# Altium project HOUZZkitF1_Tester.PrjPcb
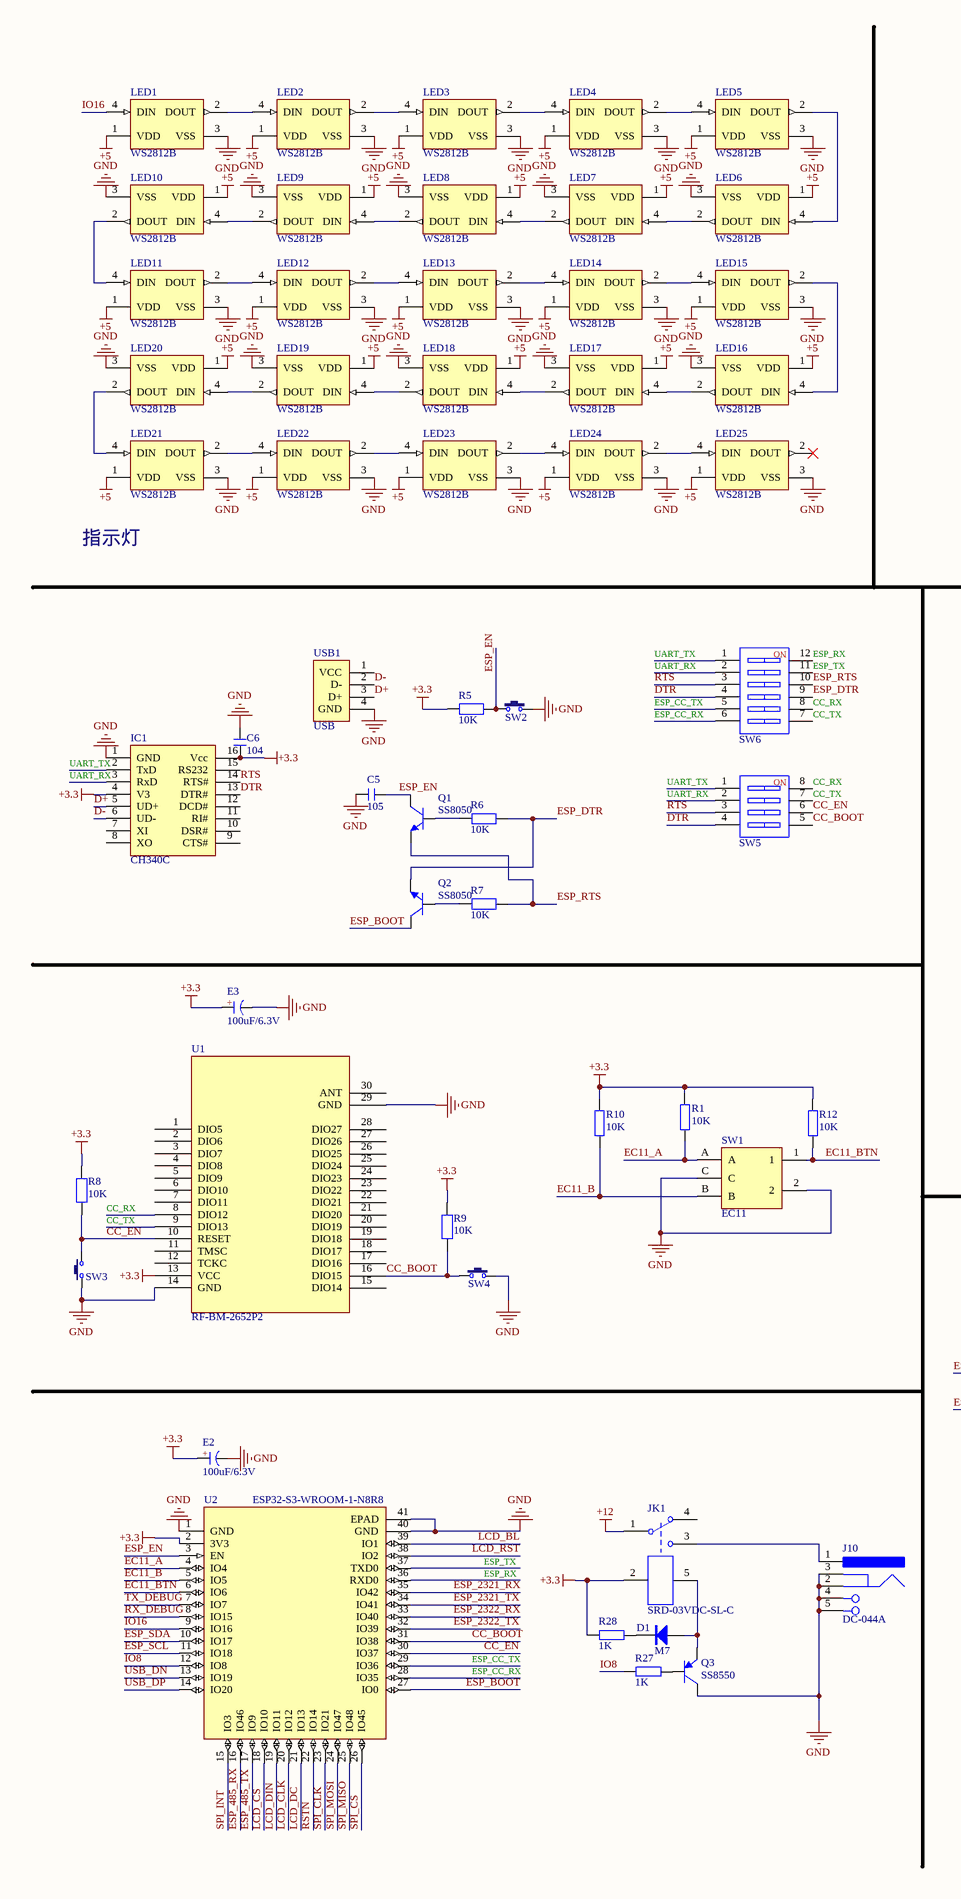
[diagram p0: HOUZZkitF1_Tester.SchDoc, left]
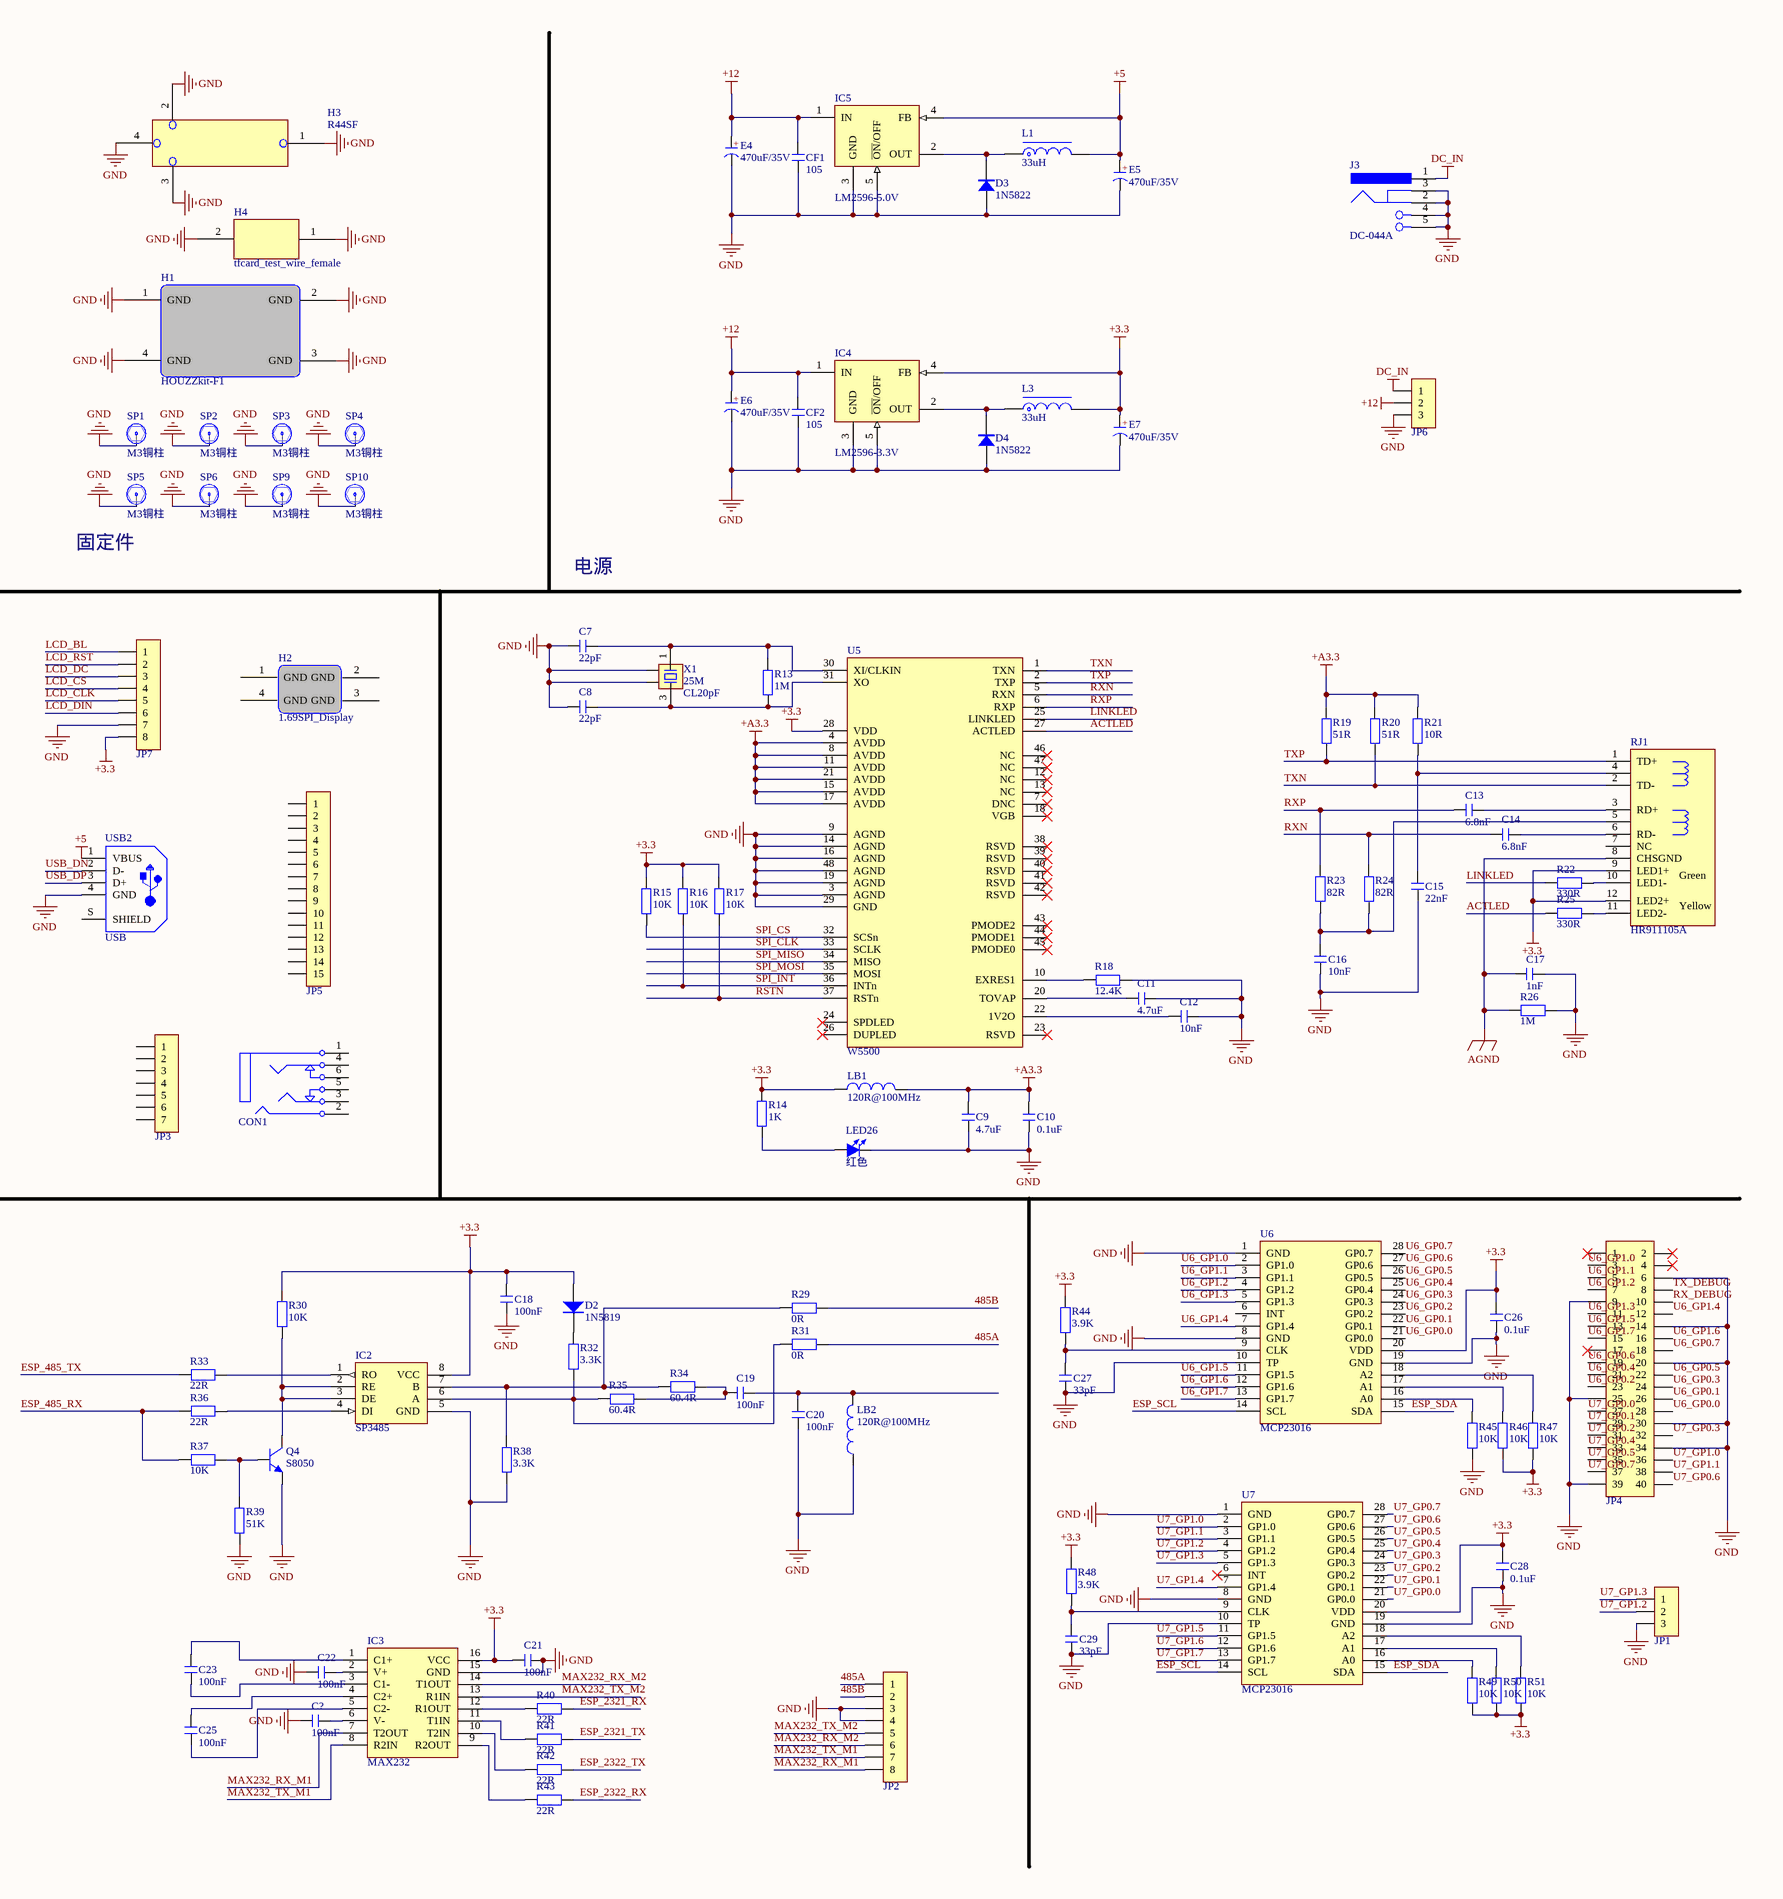
[diagram p1: HOUZZkitF1_Tester.SchDoc, right]
1 sheet, 161 parts. Net scope: global (net labels, ports and power ports of the same name join across sheets).
Board file: HOUZZkitF1_Tester.PcbDoc

## Sheet HOUZZkitF1_Tester.SchDoc
size A2; SheetNumber: 1; SheetTotal: 1

### Parts
C5  105  [C 0603_L]
C6  104  [C 0603_L]
C7  22pF  [C 0603_L]
C8  22pF  [C 0603_L]
C9  4.7uF  [C 0603_L]
C10  0.1uF  [C 0603_L]
C11  4.7uF  [C 0603_L]
C12  10nF  [C 0603_L]
C13  6.8nF  [C 0603_L]
C14  6.8nF  [C 0603_L]
C15  22nF  [C 0603_L]
C16  10nF  [C 0603_L]
C17  1nF  [C 1206_L]
C18  100nF  [C 0603_L]
C19  100nF  [C 0603_L]
C20  100nF  [C 0603_L]
C21  100nF  [C 0603_L]
C22  100nF  [C 0603_L]
C23  100nF  [C 0603_L]
C25  100nF  [C 0603_L]
C26  0.1uF  [C 0603_L]
C27  33pF  [C 0603_L]
C28  0.1uF  [C 0603_L]
C29  33pF  [C 0603_L]
C?  100nF  [C 0603_L]
CF1  105  [C 0603_L]
CF2  105  [C 0603_L]
CON1  PJ342  [PJ342A]  (value not drawn)
D1  M7  [SMA]
D2  1N5819  [SOD-123]
D3  1N5822  [SMB]
D4  1N5822  [SMB]
E2  100uF/6.3V  [CD A(3216)]
E3  100uF/6.3V  [CD A(3216)]
E4  470uF/35V  [CM F(10*10.2)]
E5  470uF/35V  [CM F(10*10.2)]
E6  470uF/35V  [CM F(10*10.2)]
E7  470uF/35V  [CM F(10*10.2)]
H1  HOUZZkit-F1  [HOUZZkit-F1]
H2  1.69SPI_Display  [1.69SPI_Display]
H3  R44SF  [R44SF]
H4  tfcard_test_wire_female  [tfcard_test_wire_female]
IC1  CH340C  [SOP16_N]
IC2  SP3485  [SOP8_N]
IC3  MAX232  [SOP16_L]
IC4  LM2596-3.3V  [TO220-5A]
IC5  LM2596-5.0V  [TO220-5A]
J3  DC-044A  [DC-044A]
J10  DC-044A  [DC-044A]
JK1  SRD-03VDC-SL-C  [SRD-03VDC-SL-C]
JP1  HDR-1X3  [MX 1.25-LS-3P]  (value not drawn)
JP2  HDR-1X8  [MX 1.25-LS-8P]  (value not drawn)
JP3  FPC1.0-7P  [FPC0.5 K-A-7PB]  (value not drawn)
JP4  Header 2X11  [IDC2.54-LI-2x20P]  (value not drawn)
JP5  FPC1.0-15P  [FPC1.0-2H-LI-15P]  (value not drawn)
JP6  HDR-1X3  [XH2.54-WS-3P]  (value not drawn)
JP7  HDR-1X8  [MX 1.25-LS-8P]  (value not drawn)
L1  33uH  [CDRH73]
L3  33uH  [CDRH73]
LB1  120R@100MHz  [FB 0805_L]
LB2  120R@100MHz  [FB 0805_L]
LED1  WS2812B  [WRSM-SMD5050-4_V]
LED2  WS2812B  [WRSM-SMD5050-4_V]
LED3  WS2812B  [WRSM-SMD5050-4_V]
LED4  WS2812B  [WRSM-SMD5050-4_V]
LED5  WS2812B  [WRSM-SMD5050-4_V]
LED6  WS2812B  [WRSM-SMD5050-4_V]
LED7  WS2812B  [WRSM-SMD5050-4_V]
LED8  WS2812B  [WRSM-SMD5050-4_V]
LED9  WS2812B  [WRSM-SMD5050-4_V]
LED10  WS2812B  [WRSM-SMD5050-4_V]
LED11  WS2812B  [WRSM-SMD5050-4_V]
LED12  WS2812B  [WRSM-SMD5050-4_V]
LED13  WS2812B  [WRSM-SMD5050-4_V]
LED14  WS2812B  [WRSM-SMD5050-4_V]
LED15  WS2812B  [WRSM-SMD5050-4_V]
LED16  WS2812B  [WRSM-SMD5050-4_V]
LED17  WS2812B  [WRSM-SMD5050-4_V]
LED18  WS2812B  [WRSM-SMD5050-4_V]
LED19  WS2812B  [WRSM-SMD5050-4_V]
LED20  WS2812B  [WRSM-SMD5050-4_V]
LED21  WS2812B  [WRSM-SMD5050-4_V]
LED22  WS2812B  [WRSM-SMD5050-4_V]
LED23  WS2812B  [WRSM-SMD5050-4_V]
LED24  WS2812B  [WRSM-SMD5050-4_V]
LED25  WS2812B  [WRSM-SMD5050-4_V]
LED26  红色  [LED 0603B]
Q1  SS8050  [SOT23-3N]
Q2  SS8050  [SOT23-3N]
Q3  SS8550  [SOT23-3N]
Q4  S8050  [SOT23-3N]
R1  10K  [R 0603_L]
R5  10K  [R 0603_L]
R6  10K  [R 0603_L]
R7  10K  [R 0603_L]
R8  10K  [R 0603_L]
R9  10K  [R 0603_L]
R10  10K  [R 0603_L]
R12  10K  [R 0603_L]
R13  1M  [R 0603_L]
R14  1K  [R 0603_L]
R15  10K  [R 0603_L]
R16  10K  [R 0603_L]
R17  10K  [R 0603_L]
R18  12.4K  [R 0603_L]
R19  51R  [R 0603_L]
R20  51R  [R 0603_L]
R21  10R  [R 0603_L]
R22  330R  [R 0603_L]
R23  82R  [R 0603_L]
R24  82R  [R 0603_L]
R25  330R  [R 0603_L]
R26  1M  [R 0603_L]
R27  1K  [R 0603_L]
R28  1K  [R 0603_L]
R29  0R  [R 0603_L]
R30  10K  [R 0603_L]
R31  0R  [R 0603_L]
R32  3.3K  [R 0603_L]
R33  22R  [R 0603_L]
R34  60.4R  [R 0603_L]
R35  60.4R  [R 0603_L]
R36  22R  [R 0603_L]
R37  10K  [R 0603_L]
R38  3.3K  [R 0603_L]
R39  51K  [R 0603_L]
R40  22R  [R 0603_L]
R41  22R  [R 0603_L]
R42  22R  [R 0603_L]
R43  22R  [R 0603_L]
R44  3.9K  [R 0603_L]
R45  10K  [R 0603_L]
R46  10K  [R 0603_L]
R47  10K  [R 0603_L]
R48  3.9K  [R 0603_L]
R49  10K  [R 0603_L]
R50  10K  [R 0603_L]
R51  10K  [R 0603_L]
RJ1  HR911105A  [RJ-45A12]
SP1  M3铜柱  [M3x4_N]
SP2  M3铜柱  [M3x4_N]
SP3  M3铜柱  [M3x4_N]
SP4  M3铜柱  [M3x4_N]
SP5  M3铜柱  [M3x4_N]
SP6  M3铜柱  [M3x4_N]
SP9  M3铜柱  [M3x4_N]
SP10  M3铜柱  [M3x4_N]
SW1  EC11  [EC11]
SW2  6x6x5  [TSW DIP-6*6*6_V]  (value not drawn)
SW3  2x4x2  [TS3x4x2]  (value not drawn)
SW4  2x4x2  [TS3x4x2]  (value not drawn)
SW5  CSW-4P  [CSW1.27 SMD-4P]  (value not drawn)
SW6  CSW-6P  [CSW1.27 SMD-6P]  (value not drawn)
U1  RF-BM-2652P2  [RF-BM-2652P2]
U2  ESP32-S3-WROOM-1-N8R8  [ESFS-ESP32-S3-WROOM-1_V]
U5  W5500  [LQFP48 7X7_N]
U6  MCP23016  [SOP28_N]
U7  MCP23016  [SOP28_N]
USB1  USB  [USB-B/S_A]
USB2  USB  [USB-A/S_A]
X1  25M  负载电容: CL20pF  [OSC 3225-4P]

### Nets
+3.3: C6.2 C18.2 C21.2 C26.2 C28.2 D2.1(A) E2.1(A) E3.1(A) E7.1(A) IC1.4(V3) IC1.16(Vcc) IC2.8(VCC) IC3.16(VCC) IC4.4(FB) JK1.2 JP7.8 L3.2 LB1.1 R1.1 R5.2 R8.2 R9.2 R10.1 R12.1 R14.2 R15.2 R16.2 R17.2 R28.2 R30.2 R44.1 R46.2 R47.2 R48.1 R49.2 R50.2 R51.2 RJ1.9(LED1+) RJ1.12(LED2+) U1.13(VCC) U2.2(3V3) U5.28(VDD) U6.20(VDD) U7.20(VDD)
+5: E5.1(A) IC5.4(FB) L1.2 LED1.1(VDD) LED2.1(VDD) LED3.1(VDD) LED4.1(VDD) LED5.1(VDD) LED6.1(VDD) LED7.1(VDD) LED8.1(VDD) LED9.1(VDD) LED10.1(VDD) LED11.1(VDD) LED12.1(VDD) LED13.1(VDD) LED14.1(VDD) LED15.1(VDD) LED16.1(VDD) LED17.1(VDD) LED18.1(VDD) LED19.1(VDD) LED20.1(VDD) LED21.1(VDD) LED22.1(VDD) LED23.1(VDD) LED24.1(VDD) LED25.1(VDD) USB2.1(VBUS)
+12: CF1.2 CF2.2 E4.1(A) E6.1(A) IC4.1(IN) IC5.1(IN) JK1.1 JP6.2
+A3.3: C9.2 C10.2 LB1.2 R19.2 R20.2 R21.2 U5.4(AVDD) U5.8(AVDD) U5.11(AVDD) U5.15(AVDD) U5.17(AVDD) U5.21(AVDD)
AGND: C17.2 R26.2 RJ1.8(CHSGND)
DC_IN: J3.1 JP6.1
GND: C5.1 C6.1 C7.1 C8.1 C9.1 C10.1 C11.2 C12.2 C15.1 C16.1 C17.1 C18.1 C20.1 C21.1 C22.2 C26.1 C27.1 C28.1 C29.1 C?.2 CF1.1 CF2.1 D3.1(A) D4.1(A) E2.2(K) E3.2(K) E4.2(K) E5.2(K) E6.2(K) E7.2(K) H1.1(GND) H1.2(GND) H1.3(GND) H1.4(GND) H3.1 H3.2 H3.3 H3.4 H4.1 H4.2 IC1.1(GND) IC2.5(GND) IC3.15(GND) IC4.3(GND) IC4.5(~{ON}/OFF) IC5.3(GND) IC5.5(~{ON}/OFF) J3.2 J3.3 J3.4(SHLD) J3.5(SHLD) J10.2 J10.3 J10.4(SHLD) J10.5(SHLD) JP1.3 JP2.3 JP2.4 JP4.6 JP4.9 JP4.14 JP4.20 JP4.25 JP4.30 JP4.34 JP4.39 JP6.3 JP7.7 LB2.1 LED1.3(VSS) LED2.3(VSS) LED3.3(VSS) LED4.3(VSS) LED5.3(VSS) LED6.3(VSS) LED7.3(VSS) LED8.3(VSS) LED9.3(VSS) LED10.3(VSS) LED11.3(VSS) LED12.3(VSS) LED13.3(VSS) LED14.3(VSS) LED15.3(VSS) LED16.3(VSS) LED17.3(VSS) LED18.3(VSS) LED19.3(VSS) LED20.3(VSS) LED21.3(VSS) LED22.3(VSS) LED23.3(VSS) LED24.3(VSS) LED25.3(VSS) LED26.2(K) Q3.3(C) Q4.2(E) R18.1 R26.1 R38.1 R39.1 R45.2 SP1.1 SP2.1 SP3.1 SP4.1 SP5.1 SP6.1 SP9.1 SP10.1 SW1.2 SW1.C SW2.2 SW3.1 SW4.2 U1.14(GND) U1.29(GND) U2.1(GND) U2.40(GND) U2.41(EPAD) U5.3(AGND) U5.9(AGND) U5.14(AGND) U5.16(AGND) U5.19(AGND) U5.29(GND) U5.48(AGND) U6.1(GND) U6.8(GND) U6.10(TP) U6.19(GND) U7.1(GND) U7.8(GND) U7.10(TP) U7.19(GND) USB1.4(GND) USB2.4(GND) X1.2 X1.4
485A: JP2.1 R31.1
485B: JP2.2 R29.1
ACTLED: R25.2 U5.27(ACTLED)
CC_BOOT: R9.1 SW4.1 SW5.5 U1.16(DIO15) U2.31(IO38)
CC_EN: R8.1 SW3.2 SW5.6 U1.10(RESET) U2.30(IO37)
CC_RX: SW5.8 SW6.8 U1.8(DIO12)
CC_TX: SW5.7 SW6.7 U1.9(DIO13)
D+: IC1.5(UD+) USB1.3(D+)
D-: IC1.6(UD-) USB1.2(D-)
DTR: IC1.13(DTR#) SW5.4 SW6.4
EC11_A: R1.2 SW1.A U2.4(IO4)
EC11_B: R10.2 SW1.B U2.5(IO5)
EC11_BTN: R12.2 SW1.1 U2.6(IO6)
ESP_485_RX: R36.2 R37.2 U2.16(IO46)
ESP_485_TX: R33.1 U2.17(IO9)
ESP_2321_RX: R40.1 U2.35(IO42)
ESP_2321_TX: R41.1 U2.34(IO41)
ESP_2322_RX: R43.1 U2.33(IO40)
ESP_2322_TX: R42.1 U2.32(IO39)
ESP_BOOT: Q2.3(C) U2.27(IO0)
ESP_CC_RX: SW6.6 U2.28(IO35)
ESP_CC_TX: SW6.5 U2.29(IO36)
ESP_DTR: Q2.2(E) R6.1 SW6.9
ESP_EN: C5.2 Q1.3(C) R5.1 SW2.1 U2.3(EN)
ESP_RTS: Q1.2(E) R7.1 SW6.10
ESP_RX: SW6.12 U2.36(RXD0)
ESP_SCL: U2.11(IO18) U6.14(SCL) U7.14(SCL)
ESP_SDA: U2.10(IO17) U6.15(SDA) U7.15(SDA)
ESP_TX: SW6.11 U2.37(TXD0)
IO8: R27.2 U2.12(IO8)
IO16: LED1.4(DIN) U2.9(IO16)
LCD_BL: JP7.1 U2.39(IO1)
LCD_CLK: JP7.5 U2.20(IO12)
LCD_CS: JP7.4 U2.18(IO10)
LCD_DC: JP7.3 U2.21(IO13)
LCD_DIN: JP7.6 U2.19(IO11)
LCD_RST: JP7.2 U2.38(IO2)
LINKLED: R22.2 U5.25(LINKLED)
MAX232_RX_M1: IC3.7(T2OUT) JP2.8
MAX232_RX_M2: IC3.14(T1OUT) JP2.6
MAX232_TX_M1: IC3.8(R2IN) JP2.7
MAX232_TX_M2: IC3.13(R1IN) JP2.5
RSTN: R17.1 U2.22(IO14) U5.37(RSTn)
RTS: IC1.14(RTS#) SW5.3 SW6.3
RX_DEBUG: JP4.10 U2.8(IO15)
RXN: C14.2 R24.2 U5.5(RXN)
RXP: C13.2 R23.2 U5.6(RXP)
SPI_CLK: U2.23(IO21) U5.33(SCLK)
SPI_CS: R15.1 U2.26(IO45) U5.32(SCSn)
SPI_INT: R16.1 U2.15(IO3) U5.36(INTn)
SPI_MISO: U2.25(IO48) U5.34(MISO)
SPI_MOSI: U2.24(IO47) U5.35(MOSI)
TX_DEBUG: JP4.8 U2.7(IO7)
TXN: R20.1 RJ1.2(TD-) U5.1(TXN)
TXP: R19.1 RJ1.1(TD+) U5.2(TXP)
U6_GP0.0: JP4.28 U6.21(GP0.0)
U6_GP0.1: JP4.26 U6.22(GP0.1)
U6_GP0.2: JP4.23 U6.23(GP0.2)
U6_GP0.3: JP4.24 U6.24(GP0.3)
U6_GP0.4: JP4.21 U6.25(GP0.4)
U6_GP0.5: JP4.22 U6.26(GP0.5)
U6_GP0.6: JP4.19 U6.27(GP0.6)
U6_GP0.7: JP4.18 U6.28(GP0.7)
U6_GP1.0: JP4.3 U6.2(GP1.0)
U6_GP1.1: JP4.5 U6.3(GP1.1)
U6_GP1.2: JP4.7 U6.4(GP1.2)
U6_GP1.3: JP4.11 U6.5(GP1.3)
U6_GP1.4: JP4.12 U6.7(GP1.4)
U6_GP1.5: JP4.13 U6.11(GP1.5)
U6_GP1.6: JP4.16 U6.12(GP1.6)
U6_GP1.7: JP4.15 U6.13(GP1.7)
U7_GP0.0: JP4.27 U7.21(GP0.0)
U7_GP0.1: JP4.29 U7.22(GP0.1)
U7_GP0.2: JP4.31 U7.23(GP0.2)
U7_GP0.3: JP4.32 U7.24(GP0.3)
U7_GP0.4: JP4.33 U7.25(GP0.4)
U7_GP0.5: JP4.35 U7.26(GP0.5)
U7_GP0.6: JP4.40 U7.27(GP0.6)
U7_GP0.7: JP4.37 U7.28(GP0.7)
U7_GP1.0: JP4.36 U7.2(GP1.0)
U7_GP1.1: JP4.38 U7.3(GP1.1)
U7_GP1.2: JP1.2 U7.4(GP1.2)
U7_GP1.3: JP1.1 U7.5(GP1.3)
U7_GP1.4: U7.7(GP1.4)
U7_GP1.5: U7.11(GP1.5)
U7_GP1.6: U7.12(GP1.6)
U7_GP1.7: U7.13(GP1.7)
UART_RX: IC1.3(RxD) SW5.2 SW6.2
UART_TX: IC1.2(TxD) SW5.1 SW6.1
USB_DN: U2.13(IO19) USB2.2(D-)
USB_DP: U2.14(IO20) USB2.3(D+)
NetC7_2: C7.2 R13.2 U5.30(XI/CLKIN) X1.1
NetC8_2: C8.2 R13.1 U5.31(XO) X1.3
NetC11_1: C11.1 U5.20(TOVAP)
NetC12_1: C12.1 U5.22(1V2O)
NetC13_1: C13.1 RJ1.3(RD+)
NetC14_1: C14.1 RJ1.6(RD-)
NetC15_2: C15.2 R21.1 RJ1.4
NetC16_2: C16.2 R23.1 R24.1 RJ1.5
NetC19_1: C19.1 C20.2 LB2.2
NetC19_2: C19.2 R34.1 R35.1
NetC22_1: C22.1 IC3.2(V+)
NetC23_1: C23.1 IC3.3(C1-)
NetC23_2: C23.2 IC3.1(C1+)
NetC25_1: C25.1 IC3.5(C2-)
NetC25_2: C25.2 IC3.4(C2+)
NetC27_2: C27.2 R44.2 U6.9(CLK)
NetC29_2: C29.2 R48.2 U7.9(CLK)
NetC?_1: C?.1 IC3.6(V-)
NetD1_1: D1.1(A) JK1.5 Q3.2(E)
NetD1_2: D1.2(K) R28.1
NetD2_2: D2.2(K) R32.2
NetD3_2: D3.2(K) IC5.2(OUT) L1.1
NetD4_2: D4.2(K) IC4.2(OUT) L3.1
NetIC2_1: IC2.1(RO) R33.2
NetIC2_2: IC2.2(RE) IC2.3(DE) Q4.3(C) R30.1
NetIC2_4: IC2.4(DI) R36.1
NetIC2_6: IC2.6(A) R31.2 R32.1 R35.2
NetIC2_7: IC2.7(B) R29.2 R34.2 R38.2
NetIC3_9: IC3.9(R2OUT) R43.2
NetIC3_10: IC3.10(T2IN) R42.2
NetIC3_11: IC3.11(T1IN) R41.2
NetIC3_12: IC3.12(R1OUT) R40.2
NetJ10_1: J10.1 JK1.3
NetLED1_2: LED1.2(DOUT) LED2.4(DIN)
NetLED2_2: LED2.2(DOUT) LED3.4(DIN)
NetLED3_2: LED3.2(DOUT) LED4.4(DIN)
NetLED4_2: LED4.2(DOUT) LED5.4(DIN)
NetLED5_2: LED5.2(DOUT) LED6.4(DIN)
NetLED6_2: LED6.2(DOUT) LED7.4(DIN)
NetLED7_2: LED7.2(DOUT) LED8.4(DIN)
NetLED8_2: LED8.2(DOUT) LED9.4(DIN)
NetLED9_2: LED9.2(DOUT) LED10.4(DIN)
NetLED10_2: LED10.2(DOUT) LED11.4(DIN)
NetLED11_2: LED11.2(DOUT) LED12.4(DIN)
NetLED12_2: LED12.2(DOUT) LED13.4(DIN)
NetLED13_2: LED13.2(DOUT) LED14.4(DIN)
NetLED14_2: LED14.2(DOUT) LED15.4(DIN)
NetLED15_2: LED15.2(DOUT) LED16.4(DIN)
NetLED16_2: LED16.2(DOUT) LED17.4(DIN)
NetLED17_2: LED17.2(DOUT) LED18.4(DIN)
NetLED18_2: LED18.2(DOUT) LED19.4(DIN)
NetLED19_2: LED19.2(DOUT) LED20.4(DIN)
NetLED20_2: LED20.2(DOUT) LED21.4(DIN)
NetLED21_2: LED21.2(DOUT) LED22.4(DIN)
NetLED22_2: LED22.2(DOUT) LED23.4(DIN)
NetLED23_2: LED23.2(DOUT) LED24.4(DIN)
NetLED24_2: LED24.2(DOUT) LED25.4(DIN)
NetLED26_1: LED26.1(A) R14.1
NetQ1_1: Q1.1(B) R6.2
NetQ2_1: Q2.1(B) R7.2
NetQ3_1: Q3.1(B) R27.1
NetQ4_1: Q4.1(B) R37.1 R39.2
NetR18_2: R18.2 U5.10(EXRES1)
NetR22_1: R22.1 RJ1.10(LED1-)
NetR25_1: R25.1 RJ1.11(LED2-)
NetR45_1: R45.1 U6.16(A0)
NetR46_1: R46.1 U6.17(A1)
NetR47_1: R47.1 U6.18(A2)
NetR49_1: R49.1 U7.16(A0)
NetR50_1: R50.1 U7.17(A1)
NetR51_1: R51.1 U7.18(A2)

Not connected (* = marked no-connect by the designer): CON1 1 2 3 4 5 6; H2 1(GND) 2(GND) 3(GND) 4(GND); IC1 7(XI) 8(XO) 9(CTS#) 10(DSR#) 11(RI#) 12(DCD#) 15(RS232); JK1 4; JP3 1 2 3 4 5 6 7; JP4 1* 2* 4* 17*; JP5 1 2 3 4 5 6 7 8 9 10 11 12 13 14 15; LED25 2(DOUT)*; RJ1 7(NC); U1 1(DIO5) 2(DIO6) 3(DIO7) 4(DIO8) 5(DIO9) 6(DIO10) 7(DIO11) 11(TMSC) 12(TCKC) 15(DIO14) 17(DIO16) 18(DIO17) 19(DIO18) 20(DIO19) 21(DIO20) 22(DIO21) 23(DIO22) 24(DIO23) 25(DIO24) 26(DIO25) 27(DIO26) 28(DIO27) 30(ANT); U5 7(DNC)* 12(NC)* 13(NC)* 18(VGB)* 23(RSVD)* 24(SPDLED)* 26(DUPLED)* 38(RSVD)* 39(RSVD)* 40(RSVD)* 41(RSVD)* 42(RSVD)* 43(PMODE2)* 44(PMODE1)* 45(PMODE0)* 46(NC)* 47(NC)*; U6 6(INT); U7 6(INT)*; USB1 1(VCC); USB2 S(SHIELD)

### Notes on the sheet
- 指示灯
- 固定件
- 电源
- (in symbol C-CD) +
- (in symbol C-CM) +
- (in symbol CSW-4P) NO
- (in symbol CSW-6P) NO
- (in symbol HR911105A) Green; Yellow

### Library data of the parts
C5-C16 C26-C29 = C: 无极性贴片电容; 版权归属: 源创客; 材质: X7R; BOM名称: 无极性贴片电容; 学习资源: www.ooocke.com
C17 = C: 2KV; BOM名称: 无极性贴片电容; 版权归属: 源创客; 材质: X7R; 学习资源: www.ooocke.com
C18-C23 C25 C? = C: x5R 10V; BOM名称: 无极性贴片电容; 版权归属: 源创客; 材质: X7R; 学习资源: www.ooocke.com
CF1 CF2 = C: X7R  25V; BOM名称: 无极性贴片电容; 版权归属: 源创客; 学习资源: www.ooocke.com; 材质: X7R
CON1 = PJ342: 3.5耳机插座,4Pin; BOM名称: 耳机插座; 版权归属: 源创客; 学习资源: www.ooocke.com
D1 = M7: 整流二极管; 版权归属: 源创客; BOM名称: 整流二极管; 学习资源: www.ooocke.com
D2 = 1N5819: 肖特基二极管; 版权归属: 源创客; 属性: 40V/2A; BOM名称: 肖特基二极管; 学习资源: www.ooocke.com
D3 D4 = SS24: 肖特基二极管; 版权归属: 源创客; 属性: 40V/2A; BOM名称: 肖特基二极管; 学习资源: www.ooocke.com
E2 E3 = C-CD: 贴片钽电容; 版权归属: 源创客; BOM名称: 贴片钽电容; 学习资源: www.ooocke.com
E4-E7 = C-CM: 贴片电解电容; 版权归属: 源创客; BOM名称: 贴片电解电容; 学习资源: www.ooocke.com
IC1 = CH340G: 串口转USB; 版权归属: 源创客; BOM名称: 串口转USB; 学习资源: www.ooocke.com
IC2 = SP3485: RS485总线收发芯片; 版权归属: 源创客; BOM名称: RS485总线收发芯片; 学习资源: www.ooocke.com
IC3 = MAX232: 版权归属: 源创客; BOM名称: MAX232; 学习资源: www.ooocke.com
IC4 = LM2596-3.3: DC降压芯片
IC5 = LM2596-5.0: DC降压芯片
J3 J10 = DC-044A: DC Power Jack, Outer Diameter 6 mm
JK1 = SRD-03VDC-SL-C: Power Relay, 3 VDC, SPDT (1c); Publisher: Bolgen Studio
JP1 JP6 = Header 3: 3P接插件; 版权归属: 源创客; BOM名称: 3P接插件; 学习资源: www.ooocke.com
JP2 JP7 = Header 8: 8P接插件; 版权归属: 源创客; BOM名称: 8P接插件; 学习资源: www.ooocke.com
JP3 = FPC-7P: FPC连接器; 版权归属: 源创客; BOM名称: FPC连接器; 学习资源: www.ooocke.com
JP4 = Header 20X2: 20*2P接插件; 版权归属: 源创客; BOM名称: 20*2P接插件; 学习资源: www.ooocke.com
JP5 = FPC-15P: FPC连接器; 版权归属: 源创客; BOM名称: FPC连接器; 学习资源: www.ooocke.com
L1 L3 = L-CDRH: 功率屏蔽电感  3A; 版权归属: 源创客; BOM名称: 功率屏蔽电感; 学习资源: www.ooocke.com
LB1 LB2 = LB: 磁珠; 版权归属: 源创客; BOM名称: 磁珠; 学习资源: www.ooocke.com
LED1-LED25 = WS2812B: Intelligent Control LED Integrated Light Source, 3.7 to 5.3 V, -25 to 85 degC, 4-Pin SMD5050, RoHS, Tape and Reel; Manufacturer: World Semiconductor; Power Supply: 3.7V - 5.3V; Max Operating Temperature: 80 degC; Min Operating Temperature: -25 degC; ComponentLink1URL: http://www.world-semi.com/; Package Quantity: 1000; ComponentLink2URL: http://www.world-semi.com/DownLoadFile/108; ComponentLink2Description: Datasheet; ComponentLink1Description: Manufacturer URL; Datasheet Version: Rev 5.0, 03/2019; Mounting Technology: Surface Mount; Package Description: 4-Pin Surface Mount Device, Body 5 x 5 mm; Package Reference: SMD5050-4; Part Number: WS2812B; Publisher: Bolgen Studio
LED26 = LED-SMD: 贴片LED; 版权归属: 源创客; BOM名称: 贴片LED; 学习资源: www.ooocke.com
Q1 Q2 Q4 = 8050-SMD: 高频放大-NPN型; 版权归属: 源创客; 属性: 40V 1.5A 1W 100MHZ; BOM名称: 高频放大-NPN型; 学习资源: www.ooocke.com
Q3 = 8550-SMD: 高频放大-PNP型; 版权归属: 源创客; 属性: 40V 1.5A 1W 100MHZ; BOM名称: 高频放大-PNP型; 学习资源: www.ooocke.com
R1 R5-R10 R12-R28 R30 R33 R36 R37 R39-R51 = R: 贴片电阻; 版权归属: 源创客; BOM名称: 贴片电阻; 学习资源: www.ooocke.com
R29 R31 R32 R34 R35 R38 = R: 5%; BOM名称: 贴片电阻; 版权归属: 源创客; 学习资源: www.ooocke.com
RJ1 = HR911105A: 带灯以太网接口; 版权归属: 源创客; BOM名称: 带灯以太网接口; 学习资源: www.ooocke.com
SP1-SP6 SP9 SP10 = 铜柱大焊盘: 铜柱; 版权归属: 源创客; BOM名称: 铜柱; 学习资源: www.ooocke.com
SW1 = EC11: 数字开关编码器
SW2 = TSW DIP-6x6_V: 侧按直插6x6轻触开关; 版权归属: 源创客; BOM名称: 直插6x6轻触开关; 学习资源: www.ooocke.com
SW3 SW4 = TSW 2x4: 3x6轻触开关; 版权归属: 源创客; BOM名称: 3x6轻触开关; 学习资源: www.ooocke.com
SW5 = CSW-4P: 4路编码开关; 版权归属: 源创客; BOM名称: 4路编码开关; 学习资源: www.ooocke.com
SW6 = CSW-6P: 6路编码开关; 版权归属: 源创客; BOM名称: 6路编码开关; 学习资源: www.ooocke.com
U2 = ESP32-S3-WROOM-1-N8R8: 2.4 GHz Wi-Fi and Bluetooth 5 Module, ESP32-S3R8, 8 MB Flash, 8 MB PSRAM, PCB Antenna, -40 to 65 degC, 40-Pin SMD, RoHS, Tape and Reel; Manufacturer: Espressif Systems; Bluetooth: Bluetooth LE v5.0; Flash: 8 MB; Frequery: 240 MHz; GPIO: 36; ROM: 384 KB; SRAM: 512 KB; Wi-Fi: IEEE 802.11 b/g/n; 2.4 GHz; HT20/40; up to 150 Mbps; Part Number: ESP32-S3-WROOM-1-N8R8; Datasheet Version: Rev. 1.0, 04/2022; Mounting Technology: Surface Mount; Publisher: Bolgen Studio; ComponentLink1Description: Manufacturer URL; ComponentLink1URL: https://www.espressif.com/; ComponentLink2Description: Datasheet Link; ComponentLink2URL: https://www.espressif.com/sites/default/files/documentation/esp32-s3-wroom-1_wroom-1u_datasheet_en.pdf; Operating Temperature: –40 °C ~ +65 °C; Package Description: 40-Pin Surface Mount Module, 18 x 25.5 mm Body, 1.27 mm Pitch, 3.1 mm Height; Package Reference: ESP32-S3-WROOM-1; PSRAM: 8 MB; Type: Module
U5 = W5500: 网络芯片; 版权归属: 源创客; BOM名称: 网络芯片; 学习资源: www.ooocke.com
U6 U7 = MCP23016: IIC 16位IO扩展芯片; 版权归属: 源创客; BOM名称: IIC 16位IO扩展芯片; 学习资源: www.ooocke.com
USB1 = USB-B/S: USB-B型母接口; 版权归属: 源创客; BOM名称: USB-B型母接口; 学习资源: www.ooocke.com
USB2 = USB-A/S: USB 2.0, Type A, Receptacle, 4 Pin; Publisher: Bolgen Studio
X1 = XTAL-4P: 4脚无源晶振; 版权归属: 源创客; BOM名称: 4脚无源晶振; 学习资源: www.ooocke.com